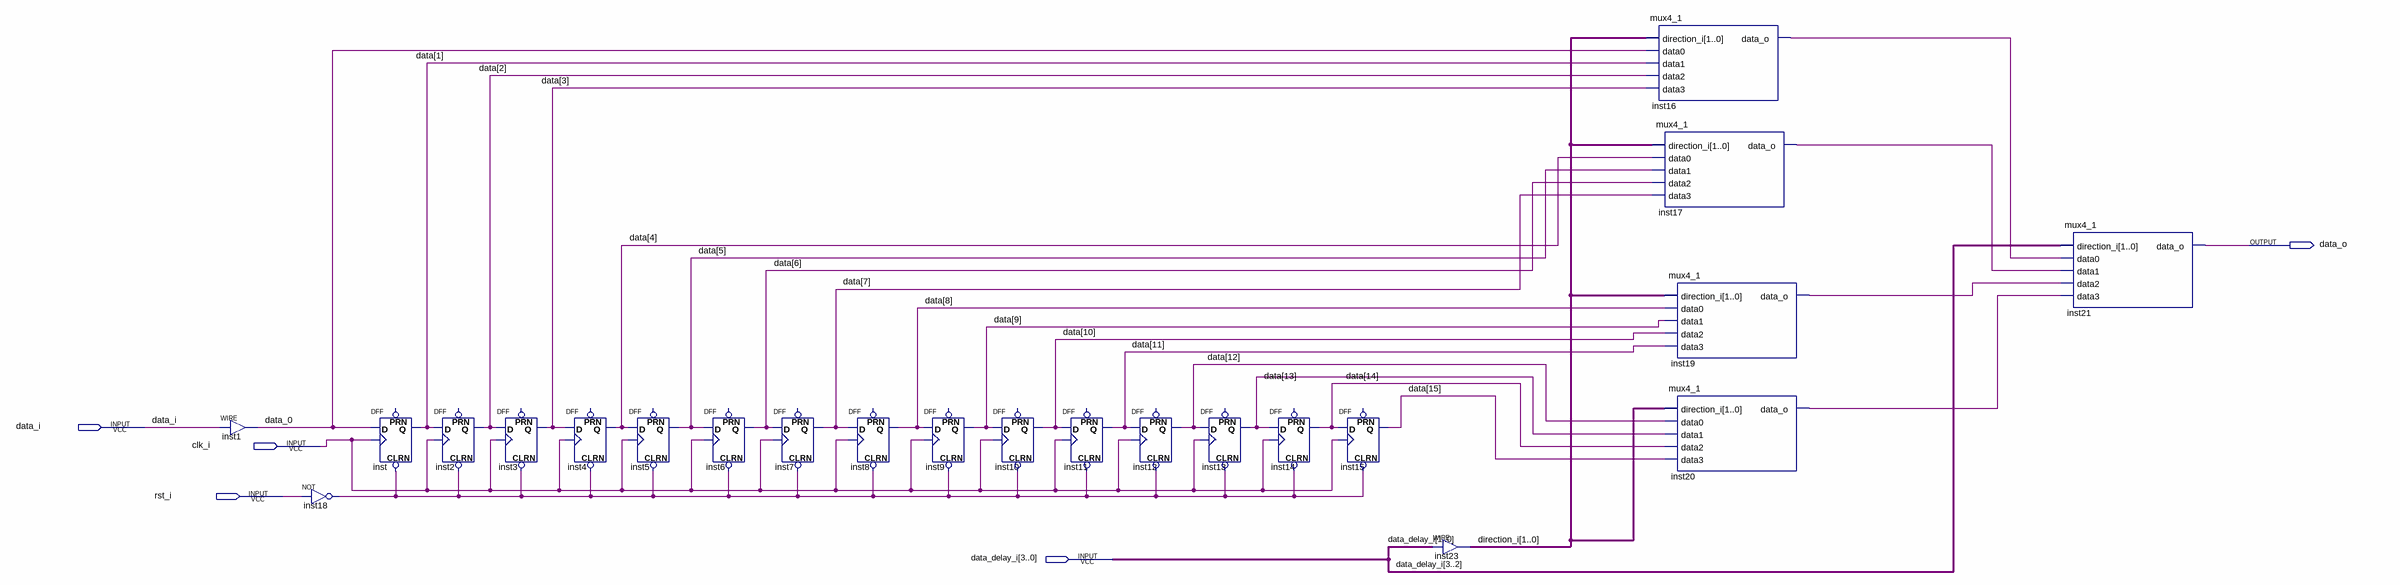
[diagram p0: schematic sheet]
// Quartus schematic delay_15.bdf as structural Verilog: 23 symbols, 5 pins
module delay_15 (
  input  data_i,
  input  clk_i,
  input  rst_i,
  input  [3:0] data_delay_i,
  output data_o
);

  wire data_0, inst16_data_o, inst17_data_o, inst18_out, inst19_data_o, inst20_data_o;
  wire [1:0] direction_i;
  wire [15:1] data;

  assign data_0 = data_i;  // WIRE inst1
  not inst18 (inst18_out, rst_i);
  DFF inst (.CLRN(inst18_out), .CLK(clk_i), .D(data_0), .Q(data[1]));  // open: PRN
  DFF inst2 (.CLRN(inst18_out), .CLK(clk_i), .D(data[1]), .Q(data[2]));  // open: PRN
  DFF inst3 (.CLRN(inst18_out), .CLK(clk_i), .D(data[2]), .Q(data[3]));  // open: PRN
  DFF inst4 (.CLRN(inst18_out), .CLK(clk_i), .D(data[3]), .Q(data[4]));  // open: PRN
  DFF inst5 (.CLRN(inst18_out), .CLK(clk_i), .D(data[4]), .Q(data[5]));  // open: PRN
  DFF inst6 (.CLRN(inst18_out), .CLK(clk_i), .D(data[5]), .Q(data[6]));  // open: PRN
  DFF inst7 (.CLRN(inst18_out), .CLK(clk_i), .D(data[6]), .Q(data[7]));  // open: PRN
  DFF inst8 (.CLRN(inst18_out), .CLK(clk_i), .D(data[7]), .Q(data[8]));  // open: PRN
  DFF inst9 (.CLRN(inst18_out), .CLK(clk_i), .D(data[8]), .Q(data[9]));  // open: PRN
  DFF inst10 (.CLRN(inst18_out), .CLK(clk_i), .D(data[9]), .Q(data[10]));  // open: PRN
  DFF inst11 (.CLRN(inst18_out), .CLK(clk_i), .D(data[10]), .Q(data[11]));  // open: PRN
  DFF inst12 (.CLRN(inst18_out), .CLK(clk_i), .D(data[11]), .Q(data[12]));  // open: PRN
  DFF inst13 (.CLRN(inst18_out), .CLK(clk_i), .D(data[12]), .Q(data[13]));  // open: PRN
  DFF inst14 (.CLRN(inst18_out), .CLK(clk_i), .D(data[13]), .Q(data[14]));  // open: PRN
  DFF inst15 (.CLRN(inst18_out), .CLK(clk_i), .D(data[14]), .Q(data[15]));  // open: PRN
  assign direction_i = data_delay_i[1:0];  // WIRE inst23
  mux4_1 inst16 (
    .direction_i(direction_i), .data0(data_0), .data1(data[1]), .data2(data[2]), .data3(data[3]),
    .data_o(inst16_data_o));
  mux4_1 inst17 (
    .direction_i(direction_i), .data0(data[4]), .data1(data[5]), .data2(data[6]), .data3(data[7]),
    .data_o(inst17_data_o));
  mux4_1 inst19 (
    .direction_i(direction_i), .data0(data[8]), .data1(data[9]), .data2(data[10]), .data3(data[11]),
    .data_o(inst19_data_o));
  mux4_1 inst20 (
    .direction_i(direction_i), .data0(data[12]), .data1(data[13]), .data2(data[14]), .data3(data[15]),
    .data_o(inst20_data_o));
  mux4_1 inst21 (
    .direction_i(data_delay_i[3:2]), .data0(inst16_data_o), .data1(inst17_data_o), .data2(inst19_data_o),
    .data3(inst20_data_o), .data_o(data_o));
endmodule
